# EAGLE design USB.BusinessCard (EAGLE 7.6.0)
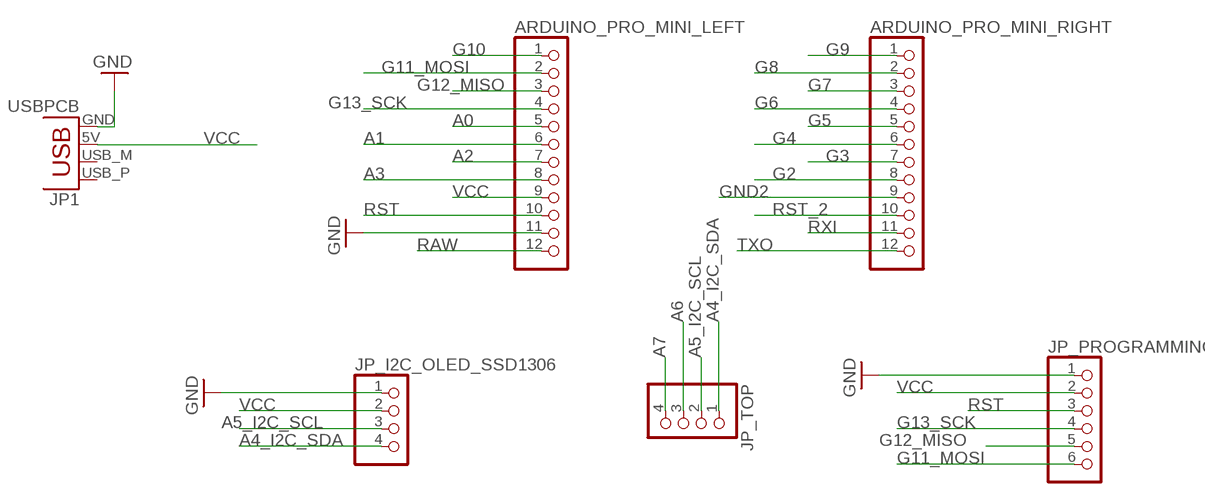
[diagram p0: schematic, sheet 1]

## Parts
ARDUINO_PRO_MINI_LEFT  PINHD-1X12  [1X12]
ARDUINO_PRO_MINI_RIGHT  PINHD-1X12  [1X12]
JP1  USBPCB  [USB-A-PCB]
JP_I2C_OLED_SSD1306  PINHD-1X4  [1X04]
JP_PROGRAMMING  PINHD-1X6  [1X06]
JP_TOP  PINHD-1X4  [1X04]

## Nets
A0: ARDUINO_PRO_MINI_LEFT.5
A1: ARDUINO_PRO_MINI_LEFT.6
A2: ARDUINO_PRO_MINI_LEFT.7
A3: ARDUINO_PRO_MINI_LEFT.8
A4_I2C_SDA: JP_I2C_OLED_SSD1306.4 JP_TOP.1
A5_I2C_SCL: JP_I2C_OLED_SSD1306.3 JP_TOP.2
A6: JP_TOP.3
A7: JP_TOP.4
G2: ARDUINO_PRO_MINI_RIGHT.8
G3: ARDUINO_PRO_MINI_RIGHT.7
G4: ARDUINO_PRO_MINI_RIGHT.6
G5: ARDUINO_PRO_MINI_RIGHT.5
G6: ARDUINO_PRO_MINI_RIGHT.4
G7: ARDUINO_PRO_MINI_RIGHT.3
G8: ARDUINO_PRO_MINI_RIGHT.2
G9: ARDUINO_PRO_MINI_RIGHT.1
G10: ARDUINO_PRO_MINI_LEFT.1
G11_MOSI: ARDUINO_PRO_MINI_LEFT.2 JP_PROGRAMMING.6
G12_MISO: ARDUINO_PRO_MINI_LEFT.3 JP_PROGRAMMING.5
G13_SCK: ARDUINO_PRO_MINI_LEFT.4 JP_PROGRAMMING.4
GND: ARDUINO_PRO_MINI_LEFT.11 JP1.GND JP_I2C_OLED_SSD1306.1 JP_PROGRAMMING.1
GND2: ARDUINO_PRO_MINI_RIGHT.9
RAW: ARDUINO_PRO_MINI_LEFT.12
RST: ARDUINO_PRO_MINI_LEFT.10 JP_PROGRAMMING.3
RST_2: ARDUINO_PRO_MINI_RIGHT.10
RXI: ARDUINO_PRO_MINI_RIGHT.11
TXO: ARDUINO_PRO_MINI_RIGHT.12
VCC: ARDUINO_PRO_MINI_LEFT.9 JP1.5V(VBUS) JP_I2C_OLED_SSD1306.2 JP_PROGRAMMING.2
Unconnected: JP1.USB_M(D-) JP1.USB_P(D+)

## Library data of the parts
ARDUINO_PRO_MINI_LEFT ARDUINO_PRO_MINI_RIGHT = adafruit:PINHD-1X12: PIN HEADER
JP1 = SparkFun-Connectors:USB: USB Connectors USB-B-PTH is fully proven SKU : PRT-00139/CONN-08278 USB-miniB is fully proven SKU : PRT-00587 USB-A-PCB is untested. USB-A-H is throughly reviewed, but untested. Spark Fun Electronics SKU : PRT-00437 USB-B-SMT is throughly reviewed, but untested. Needs silkscreen touching up. USB-A-S has not been used/tested USB-MB-H has not been used/tested USB-MICROB has been used. CONN-09505
JP_I2C_OLED_SSD1306 JP_TOP = pinhead:PINHD-1X4: PIN HEADER
JP_PROGRAMMING = adafruit:PINHD-1X6: PIN HEADER

## Board
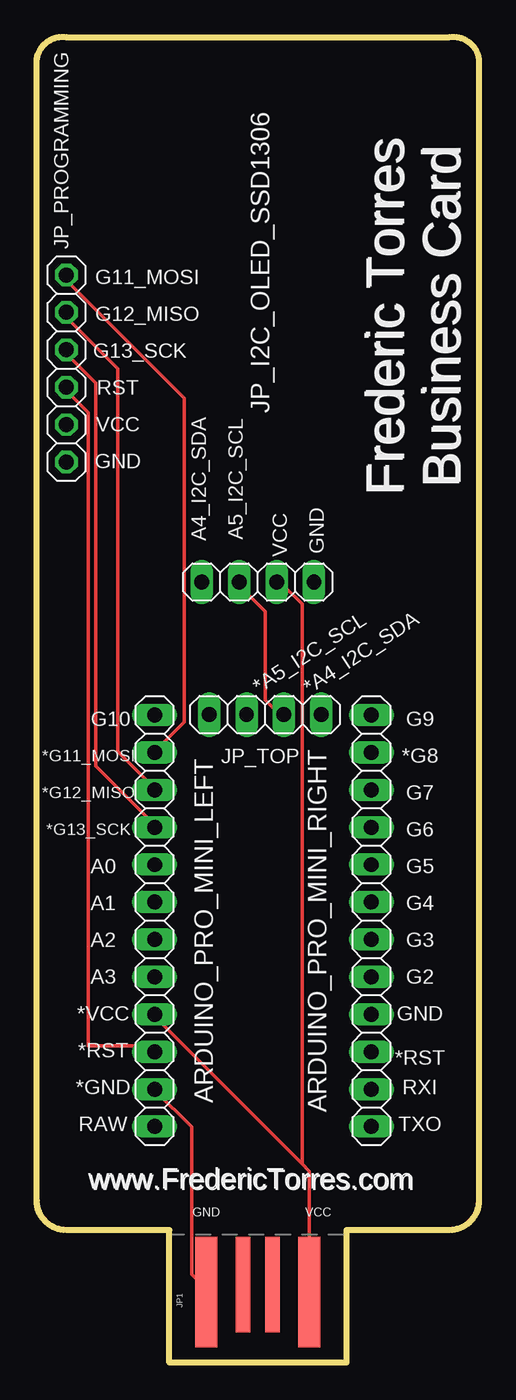
[diagram p1: board, top side]
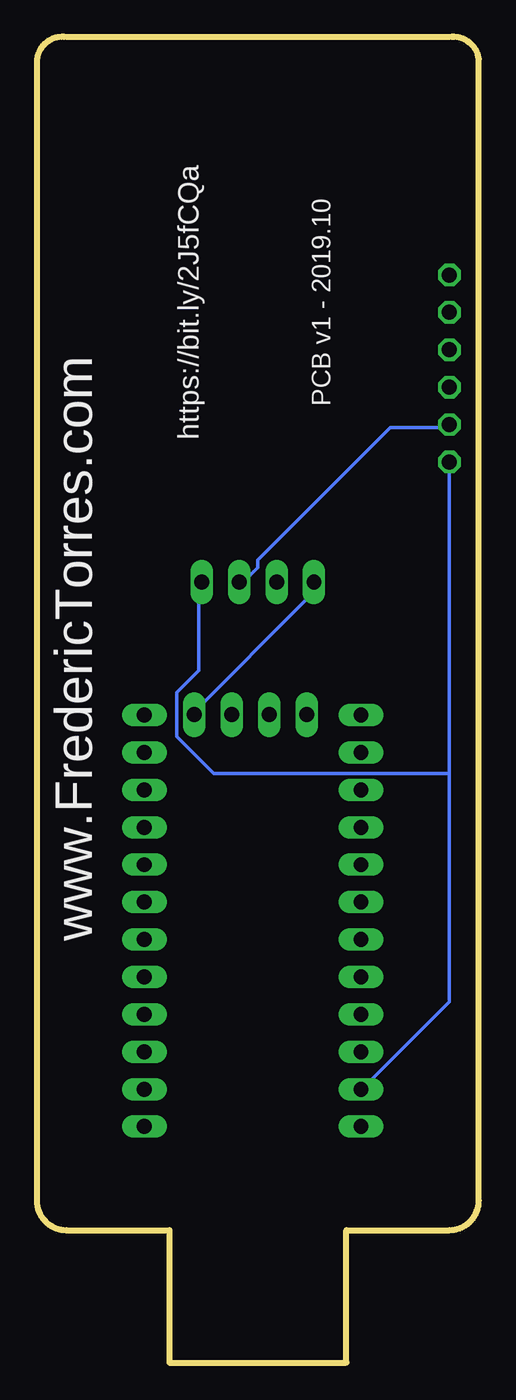
[diagram p2: board, bottom side, seen from below]

Size 30 x 90.02 mm. Coordinates in mm from the lower left corner, seen from the top.
Outline: 21,9 21,0 9,0 9,9 2,9 arc-90 0,11 0,88.5 arc-90 2,90 28,90 arc-90 30,88.5 30,11 arc-90 28,9 21,9
Copper layers (1*16): Top 0.035mm / dielectric 1.5mm / Bottom 0.035mm
Design rules "default": minimum track width 10mil, minimum drill 24mil, track to track 8mil, track to pad 8mil, pad to pad 8mil, via to via 8mil, smd to smd 8mil, copper to edge 40mil, drill to drill 8mil, minimum pad ring 10mil, minimum via ring 8mil, stop-mask expansion 4mil, vias tented up to drill 0mil, thermal gap 10mil

### Footprints (pad centres in the part's own frame; a part is rotated, then mirrored left to right if it is on the bottom)
1X12 = drill 1.016 long: 1 -13.97,0; 2 -11.43,0; 3 -8.89,0; 4 -6.35,0; 5 -3.81,0; 6 -1.27,0; 7 1.27,0; 8 3.81,0; 9 6.35,0; 10 8.89,0; 11 11.43,0; 12 13.97,0
USB-A-PCB = smd 7.5 x 1.5: 5V -0.2,-3.5; GND -0.2,3.5 | smd 6.5 x 1: USB_M 0.3,-1; USB_P 0.3,1
1X04 = drill 1.016 long: 1 -3.81,0; 2 -1.27,0; 3 1.27,0; 4 3.81,0
1X06 = drill 1.016 octagon: 1 -6.35,0; 2 -3.81,0; 3 -1.27,0; 4 1.27,0; 5 3.81,0; 6 6.35,0

### Placement (x,y rotation side)
ARDUINO_PRO_MINI_LEFT  8,30 270 top
ARDUINO_PRO_MINI_RIGHT  22.7,30 270 top
JP1  15,5 90 top
JP_I2C_OLED_SSD1306  15,53 180 top
JP_PROGRAMMING  2,67.5 90 top
JP_TOP  15.5,44 180 top

### Tracks (layer width: path | path; a pad name or v marks a point on that pad's centre or on a via)
A4_I2C_SDA
  Bottom 0.254: JP_I2C_OLED_SSD1306.4 11.5,53 11.5,52 19.5,44 JP_TOP.1
A5_I2C_SCL
  Top 0.254: JP_TOP.2 16.5,44 15.5,45 15.5,51 14,52.5 14,53 JP_I2C_OLED_SSD1306.3
G11_MOSI
  Top 0.254: ARDUINO_PRO_MINI_LEFT.2 8,41.5 10,43.5 10,65.5 2,73.5 JP_PROGRAMMING.6
G12_MISO
  Top 0.254: ARDUINO_PRO_MINI_LEFT.3 8,39 5.5,41.5 5.5,67.5 2,71 JP_PROGRAMMING.5
G13_SCK
  Top 0.254: ARDUINO_PRO_MINI_LEFT.4 8,36.5 4,40.5 4,66.5 2,68.5 JP_PROGRAMMING.4
GND
  Top 0.254: JP1.GND 11.5,5 10.5,6 10.5,16 8,18.5 ARDUINO_PRO_MINI_LEFT.11
  Bottom 0.254: 2,40 2,24.5 8,18.5 ARDUINO_PRO_MINI_LEFT.11 | 2,40 JP_PROGRAMMING.1 | 2,40 18,40 20.5,42.5 20.5,45.5 19,47 19,53 JP_I2C_OLED_SSD1306.1
RST
  Top 0.254: ARDUINO_PRO_MINI_LEFT.10 8,21.5 3.5,21.5 3.5,64.5 2,66 JP_PROGRAMMING.3
VCC
  Top 0.254: 18,13.5 18.5,13 JP1.5V | 18,13.5 8,23.5 ARDUINO_PRO_MINI_LEFT.9 | 18,13.5 18,51.5 16.5,53 JP_I2C_OLED_SSD1306.2
  Bottom 0.254: JP_I2C_OLED_SSD1306.2 16,53 15,54 15,54.5 6,63.5 2,63.5 JP_PROGRAMMING.2

### Text on the board
tNames: G11_MOSI | G12_MISO | Frederic Torres / Business Card | Frederic Torres / Business Card | G13_SCK | RST | VCC | GND | A4_I2C_SDA | A5_I2C_SCL | VCC | GND | *A5_I2C_SCL | *A4_I2C_SDA | G10 | G9 | *G11_MOSI | *G8 | *G12_MISO | G7 | *G13_SCK | G6 | A0 | G5 | A1 | G4 | A2 | G3 | A3 | G2 | *VCC | GND | *RST | *RST | *GND | RXI | RAW | TXO | www.FredericTorres.com | www.FredericTorres.com | GND | VCC
bNames: PCB v1 - 2019.10 | https://bit.ly/2J5fCQa | www.FredericTorres.com